# EAGLE design Adafruit AirLift Breakout (EAGLE 9.2.0)
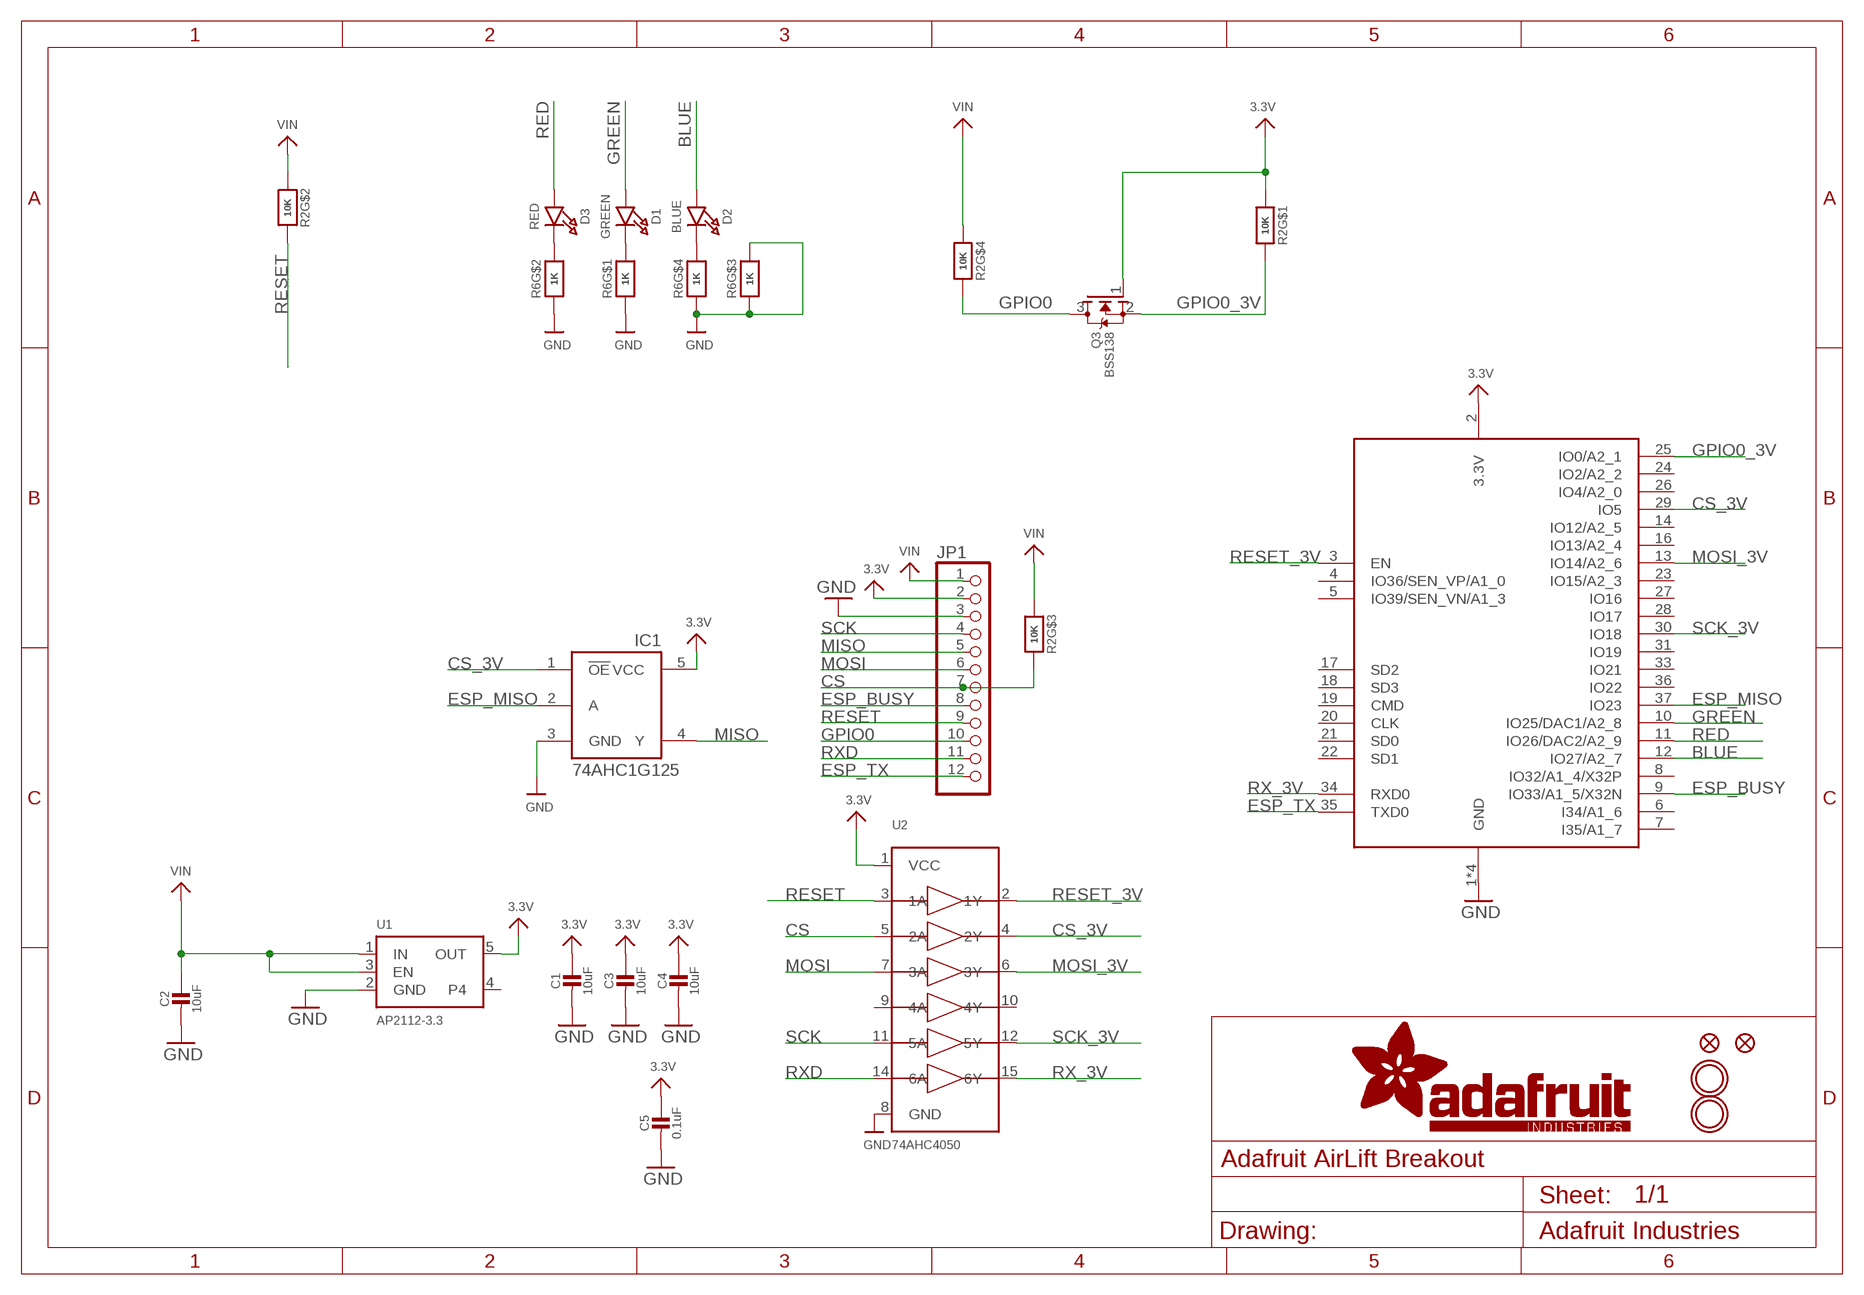
[diagram p0: schematic, sheet 1]

## Parts
C1  10uF  CAP_CERAMIC0805-NOOUTLINE  [0805-NO]
C2  10uF  CAP_CERAMIC0805-NOOUTLINE  [0805-NO]
C3  10uF  CAP_CERAMIC0805-NOOUTLINE  [0805-NO]
C4  10uF  CAP_CERAMIC0805-NOOUTLINE  [0805-NO]
C5  0.1uF  CAP_CERAMIC0603_NO  [0603-NO]
D1  GREEN  LED0603_NOOUTLINE  [CHIPLED_0603_NOOUTLINE]
D2  BLUE  LED0603_NOOUTLINE  [CHIPLED_0603_NOOUTLINE]
D3  RED  LED0603_NOOUTLINE  [CHIPLED_0603_NOOUTLINE]
FID1  FIDUCIAL_1MM  [FIDUCIAL_1MM]
FID3  FIDUCIAL_1MM  [FIDUCIAL_1MM]
IC1  74AHC1G125  [SOT23-5L]
JP1  HEADER-1X12  [1X12_ROUND]
Q3  BSS138  MOSFET-NWIDE  [SOT23-WIDE]
R2  10K  RESISTOR_4PACK  [RESPACK_4X0603]
R6  1K  RESISTOR_4PACK  [RESPACK_4X0603]
U1  AP2112-3.3  VREG_SOT23-5  [SOT23-5]
U2  74AHC4050  74HC4050DTSSOP  [TSSOP16]
U$15  MOUNTINGHOLE2.5  [MOUNTINGHOLE_2.5_PLATED]
U$16  MOUNTINGHOLE2.5  [MOUNTINGHOLE_2.5_PLATED]
X1  ESP32_WROOM32  [WROOM32]

## Nets
3.3V: C1.1 C3.1 C4.1 C5.1 IC1.5(VCC) JP1.2 Q3.1(G) R2.8 U1.5(OUT) U2.1(VCC) X1.2(3.3V)
BLUE: D2.A X1.12(IO27/A2_7)
CS: JP1.7 R2.6 U2.5(2A)
CS_3V: IC1.1(!OE) U2.4(2Y) X1.29(IO5)
ESP_BUSY: JP1.8 X1.9(IO33/A1_5/X32N)
ESP_MISO: IC1.2(A) X1.37(IO23)
ESP_TX: JP1.12 X1.35(TXD0)
GND: C1.2 C2.2 C3.2 C4.2 C5.2 IC1.3(GND) JP1.3 R6.1 R6.2 R6.3 R6.4 R6.6 U1.2(GND) U2.8(GND) X1.1(GND) X1.15(GND) X1.38(GND) X1.P$1(GND)
GPIO0: JP1.10 Q3.3(D) R2.4
GPIO0_3V: Q3.2(S) R2.1 X1.25(IO0/A2_1)
GREEN: D1.A X1.10(IO25/DAC1/A2_8)
MISO: IC1.4(Y) JP1.5
MOSI: JP1.6 U2.7(3A)
MOSI_3V: U2.6(3Y) X1.13(IO14/A2_6)
N$1: D3.C R6.7
N$2: D1.C R6.8
N$3: D2.C R6.5
RED: D3.A X1.11(IO26/DAC2/A2_9)
RESET: JP1.9 R2.7 U2.3(1A)
RESET_3V: U2.2(1Y) X1.3(EN)
RX_3V: U2.15(6Y) X1.34(RXD0)
RXD: JP1.11 U2.14(6A)
SCK: JP1.4 U2.11(5A)
SCK_3V: U2.12(5Y) X1.30(IO18)
VIN: C2.1 JP1.1 R2.2 R2.3 R2.5 U1.1(IN) U1.3(EN)
Unconnected: U1.4 U2.9(4A) U2.10(4Y) X1.4(IO36/SEN_VP/A1_0) X1.5(IO39/SEN_VN/A1_3) X1.6(I34/A1_6) X1.7(I35/A1_7) X1.8(IO32/A1_4/X32P) X1.14(IO12/A2_5) X1.16(IO13/A2_4) X1.17(SD2) X1.18(SD3) X1.19(CMD) X1.20(CLK) X1.21(SD0) X1.22(SD1) X1.23(IO15/A2_3) X1.24(IO2/A2_2) X1.26(IO4/A2_0) X1.27(IO16) X1.28(IO17) X1.31(IO19) X1.33(IO21) X1.36(IO22)

## Library data of the parts
C1-C5 = microbuilder:CAP_CERAMIC: Ceramic Capacitors For new designs, use the packages preceded by an '_' character since they are more reliable: The following footprints should be used on most boards: _0402 - Standard footprint for regular board layouts _0603 - Standard footprint for regular board layouts _0805 - Standard footprint for regular board layouts _1206 - Standard footprint for regular board layouts For extremely tight-pitch boards where space is at a premium, the following 'micro-pitch' footprints can be used (smaller pads, no silkscreen outline, etc.): _0402MP - Micro-pitch footprint for very dense/compact boards _0603MP - Micro-pitch footprint for very dense/compact boards _0805MP - Micro-pitch footprint for very dense/compact boards _1206MP - Micro-pitch footprint for very dense/compact boards
D1-D3 = microbuilder:LED: LED 0603 - 0603 Surface Mount Package 2mA: Green LED - Low Power (3.9mcd, 2ma, 1.7Vf) - Digikey: 475-2709-2-ND Orange LED - Low Power (9.8mcd, 2ma, 1.8Vf) - Digikey: 475-1194-2-ND Red LED - Low Power (5mcd, 2ma, 1.8Vf) - Digikey: 475-1195-2-ND Yellow LED - Low Power (7mcd, 2ma, 1.8Vf) - Digikey: 475-1196-2-ND 5mA: Blue LED - Low Power (17mcd, 5ma, 2.9Vf) - Digikey: LNJ937W8CRACT-ND 0805 - 0805 Surface Mount Package 2mA: Red LED (8.8mcd, 2mA, 1.8Vf, Clear) - Low Power [Digikey: 475-2510-1-ND] Green LED (5mcd, 2mA, 1.8Vf, Clear) - Low Power [Digikey: 475-2730-1-ND] Yellow LED (11.3mcd, 2mA, 1.8Vf, Clear) - Low Power [Digikey: 475-2555-1-ND] 20mA: Red LED (104mcd, 20mA, Diffused) - LS R976 [Digikey: 475-1278-6-ND] Red LED (12mcd, 20mA, 2.0Vf, Clear) - APT2012EC [Digikey: 754-1128-1-ND] Green LED (15mcd, 20mA, 2.2Vf, Clear) - APT2012GC [Digikey: 754-1131-1-ND] Orange LED (160mcd, 20mA, 2.1Vf, Clear) - APT2012SECK [Digikey: 754-1130-1-ND] 1206 - 1206 Surface Mount Package Green LED (26mcd, 20mA, Diffused) - LG N971 [Digikey: 475-1407-6-ND] Red LED (15mcd, 20mA, Diffused) - LH N974 [Digikey: 475-1416-6-ND] Cree - Cree High-Power Surface Mount LEDs XPEBWT-L1-0000-00D50 - White 111lm 350mA 2.9Vf 6200K 110° XTEAWT-00-0000-00000LEE3 - White 114lm 350mA 2.85Vf 5000K 115° Everlight - Everlight 45-21 Series Surface Mount LEDs 45-21/QK2C-B2832AC2CB2/2T - Warm White 2000mcd 20mA 3.25Vf 3050K 120° 45-21/LK2C-B38452C4CB2/2T - Nuetral White 2000mcd 20mA 3.25Vf 4150K 120° 45-21/LK2C-B50634C6CB2/2T - Cold White 2200mcd 20mA 3.25Vf 5650K 120° PLCC2 Reverse Mount LS T77K-J1L2-1-0-2-R18-Z - Red 11.25mcd 2mA 1.8Vf 630nm 120° LO T77K-L1M2-24-Z - Orange 19.6mcd 2mA 1.8Vf 606nm 120° LY T77K-K2M1-26-Z - Yellow 15.7mcd 2mA 1.8Vf 587nm 120°
FID1 FID3 = microbuilder:FIDUCIAL: Fiducial Alignment Points Various fiducial points for machine vision alignment.; BOM: EXCLUDE
IC1 = adafruit:74AHC1G125
JP1 = microbuilder:HEADER-1X12
Q3 = microbuilder:MOSFET-N: N-Channel Mosfet LEGEND VDS: Voltage Drain-Source ID: Drain Current RDS(ON): Drain-Source On-State Resistance VGS(TH): Gate-Source Threshold Voltage CISS: Drain-Source Input Capacitance SOT-23 Name VDS ID RDS(ON) VGS(TH) CISS Order Number 2N7002E 60V 260mA 2.5 Ohm 2.5V @ 250uA 26.7pF @ 25V 2N7002ET1GOSTR-ND BSH103 30V 850mA 400 mOhm 400mV @ 1mA 83pF @ 24V BSH103,235-ND BSS138 60V 320mA 1.6 Ohm 1.5V @ 250uA 50pF @ 10V Mouser: 771-BSS138PW115 DMN2075U-7 20V 4.2A 38 mOhm 1V @ 250 uA 594.3pF @ 10V DMN2075U-7DICT-ND * BSS138 good choice for I2C level-shifting POWERPAK 1212-8 Name VDS ID RDS(ON) VGS(TH) CISS Order Number Si7308DN 60V 6A 58 mOhm 3V @ 250uA 665pF @ 15V SI7308DN-T1-E3CT-ND
R2 R6 = microbuilder:RESISTOR_4PACK: Resistor Packs (4 resistors) 4 x 0603 10K 1/16W - Digikey: YC164J-10KCT-ND
U1 = microbuilder:VREG_SOT23-5: SOT23-5 Fixed Voltage Regulators Part Current Out V Out V In V Dropout θJA (°C/W) TJ (°C) Digikey Part No. ADP121 150mA 3.3V 3.4-5.5V 0.09V @ 150mA -- -- ADP121-AUJZ33R7CT-ND ADP121 150mA 3.0V 3.1-5.5V 0.09V @ 150mA -- -- ADP121-AUJZ30R7CT-ND ADP122 300mA 3.3V 3.4-5.5V 0.085V @ 300mA -- -- ADP122AUJZ-3.3-R7CT-ND ADP1712 300mA 3.3V 3.5-5.5V 0.17V @ 300mA -- -- ADP1712AUJZ-3.3-R7TR-ND AP7311 (Low Cost) 150mA 3.3V 3.5-6V 0.15V @ 150mA -- -- AP7311-33WG-7DICT-ND LD39015M18R 150mA 1.8V 1.9V-5.5V 0.08V @ 100mA -- -- 497-6977-1-ND LP2985A-33DBVR 150mA 3.3V 3.3-16V 0.28V @ 150mA 206 150 296-18479-1-ND MCP1824T-3302E/OT 300mA 3.3V 3.5V-6V 0.2V @ 300mA -- -- MCP1824T-3302E/OTCT-ND MIC5205-2.5YM5 TR 150mA 2.5V 2.7-16V 0.165V @ 150mA -- -- 576-1257-2-ND MIC5205-3.0YM5 TR 150mA 3.0V 3.2V-16V 0.165V @ 150mA -- -- 576-1258-2-ND MIC5205-3.3YM5 TR 150mA 3.3V 3.5V-16V 0.165V @ 150mA -- -- 576-1259-2-ND TPS780330220 150mA 3.3V+2.2V 3.6-5.5V 250mV Max -- -- 296-23332-1-ND TDA3663/N1,135 100mA 3.3V 3.5-45V 0.18V @ 50mA -- -- 568-5343-1-ND Max operating temp can be calculated using θJA, TJ (max junction temperature), and power in watts. Set the "Maximum Ambient Temperature" until it reaches TJ ("Max Junction Temperature"), which is the absolute limit for safe use of the regulator: Heat Sink Temperature Calculator <http://www.daycounter.com/Calculators/Heat-Sink-Temperature-Calculator.phtml> For example, With 12V source into a 3.3V LP2985 and a 30mA load, we are dissipating (12V-3.3V) * 0.03A = 0.261W. With a θJA of 206 °C/W, a TJ of 150°C, and 261mW we can safely use the chip without a heat sink up to 75°C (=147.1°C Junction Temperature).
U2 = microbuilder:74HC4050D: 6-channel level shifter 74HC4050D - 2V-6V Supply SOIC16 Digikey: 74HC4050D,653-ND Mouser: 771-74HC4050D-T TSSOP16 Digikey: 296-9215-1-ND Mouser:
U$15 U$16 = microbuilder:MOUNTINGHOLE: Mounting Hole For #2 screws (0.086"/2.18mm width, 0.094"/2.4mm hole) use 2.5mm; BOM: EXCLUDE
X1 = microbuilder:ESP32_WROOM32

## Net classes
1 power: width 0.305 mm

## Board
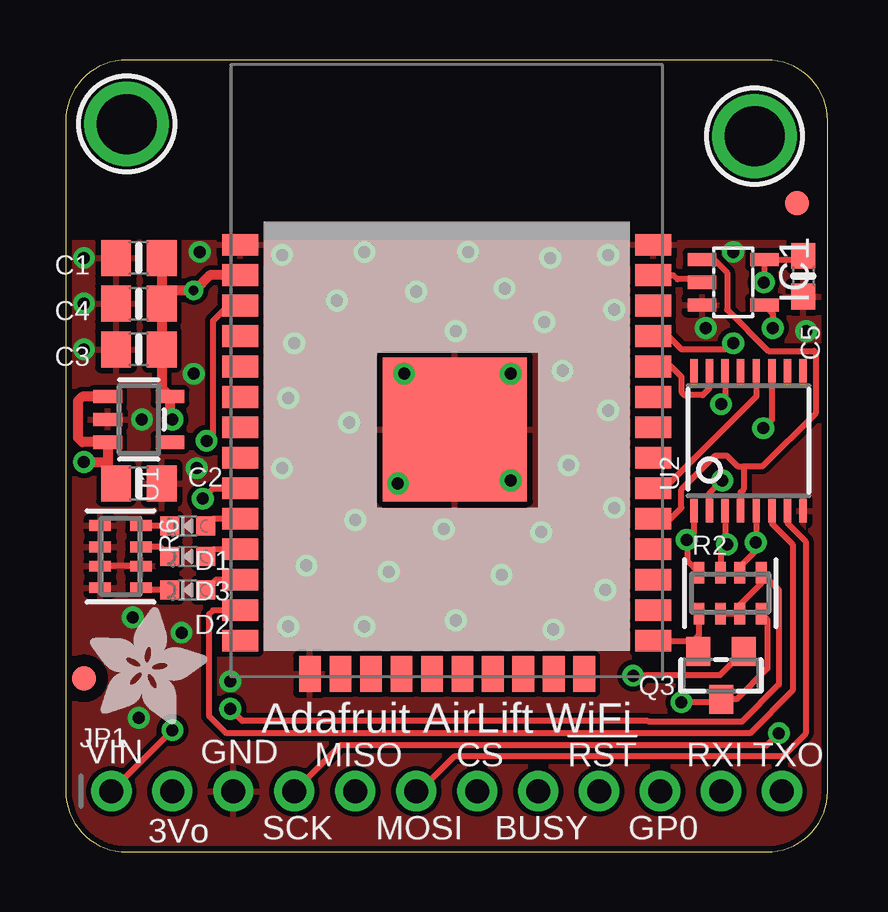
[diagram p1: board, top side]
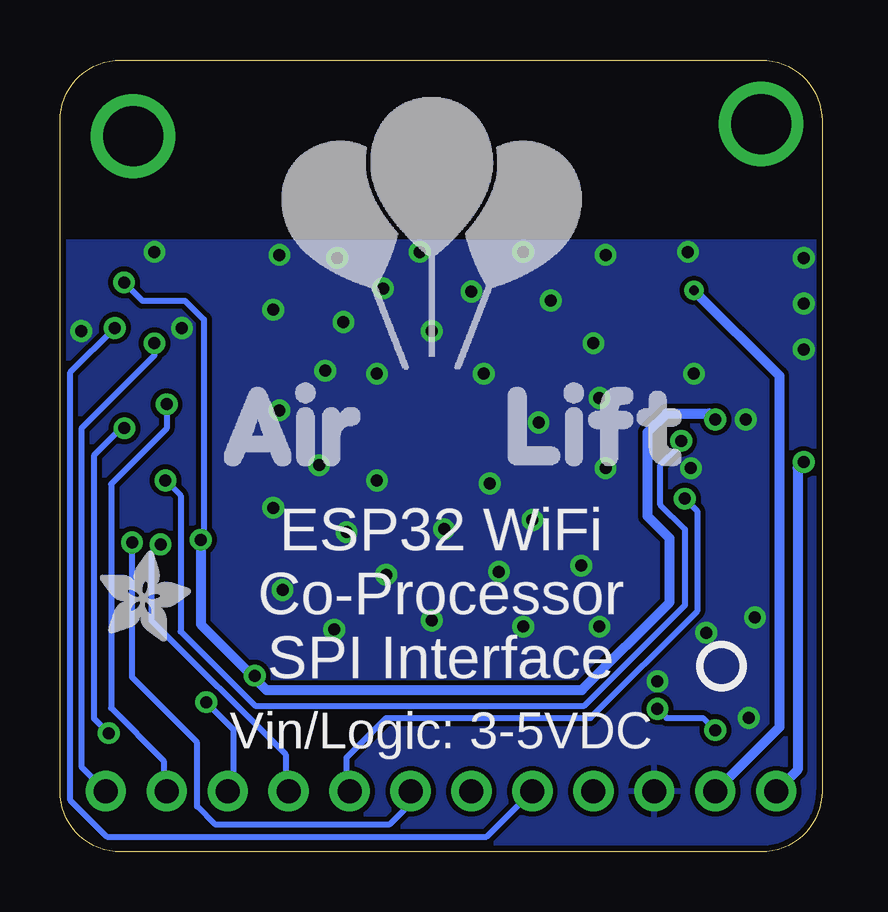
[diagram p2: board, bottom side, seen from below]

Size 31.75 x 33.02 mm. Coordinates in mm from the lower left corner, seen from the top.
Outline: 0,30.48 0,2.54 arc90 2.54,0 29.21,0 arc90 31.75,2.54 31.75,30.48 arc90 29.21,33.02 2.54,33.02 arc90 0,30.48
Copper layers (1*16): Top 0.035mm / dielectric 1.5mm / Bottom 0.035mm
Design rules "adafruit *": minimum track width 10mil, minimum drill 15.5mil, track to track 8mil, track to pad 8mil, pad to pad 8mil, via to via 8mil, smd to smd 8mil, copper to edge 10mil, drill to drill 8mil, minimum pad ring 10mil, minimum via ring 8mil, stop-mask expansion 2mil, vias tented up to drill 20mil, thermal gap 10mil

### Footprints (pad centres in the part's own frame; a part is rotated, then mirrored left to right if it is on the bottom)
0805-NO = smd 1.24 x 1.5: 1 -0.95,0; 2 0.95,0
0603-NO = smd 1.075 x 1: 1 -0.85,0; 2 0.85,0
CHIPLED_0603_NOOUTLINE = smd 0.8 x 0.8: A 0,-0.75; C 0,0.75
FIDUCIAL_1MM = smd 1 x 1: 1 0,0
SOT23-5L = smd 0.55 x 1.2: 1 -0.95,-1.3; 2 0,-1.3; 3 0.95,-1.3; 4 0.95,1.3; 5 -0.95,1.3
1X12_ROUND = drill 1 pad 1.676: 1 -13.97,0; 2 -11.43,0; 3 -8.89,0; 4 -6.35,0; 5 -3.81,0; 6 -1.27,0; 7 1.27,0; 8 3.81,0; 9 6.35,0; 10 8.89,0; 11 11.43,0; 12 13.97,0
SOT23-WIDE = smd 1 x 1.2: 1 -0.95,-1; 2 0.95,-1; 3 0,1
RESPACK_4X0603 = smd 0.45 x 0.9: 1 -1.3,-0.85; 2 -0.4,-0.85; 3 0.4,-0.85; 4 1.3,-0.85; 5 1.3,0.85; 6 0.4,0.85; 7 -0.4,0.85; 8 -1.3,0.85
SOT23-5 = smd 0.55 x 1.2: 1 -0.95,-1.3; 2 0,-1.3; 3 0.95,-1.3; 4 0.95,1.3; 5 -0.95,1.3
TSSOP16 = smd 0.305 x 0.991: 1 -2.275,-2.918; 2 -1.625,-2.918; 3 -0.975,-2.918; 4 -0.325,-2.918; 5 0.325,-2.918; 6 0.975,-2.918; 7 1.625,-2.918; 8 2.275,-2.918; 9 2.275,2.918; 10 1.625,2.918; 11 0.975,2.918; 12 0.325,2.918; 13 -0.325,2.918; 14 -0.975,2.918; 15 -1.625,2.918; 16 -2.275,2.918
MOUNTINGHOLE_2.5_PLATED = drill 2.5 pad 3.2: P$1 0,0
WROOM32 = smd 1.5 x 0.9: 1 -8.6,5; 2 -8.6,3.73; 3 -8.6,2.46; 4 -8.6,1.19; 5 -8.6,-0.08; 6 -8.6,-1.35; 7 -8.6,-2.62; 8 -8.6,-3.89; 9 -8.6,-5.16; 10 -8.6,-6.43; 11 -8.6,-7.7; 12 -8.6,-8.97; 13 -8.6,-10.24; 14 -8.6,-11.51; 25 8.6,-11.51; 26 8.6,-10.24; 27 8.6,-8.97; 28 8.6,-7.7; 29 8.6,-6.43; 30 8.6,-5.16; 31 8.6,-3.89; 32 8.6,-2.62; 33 8.6,-1.35; 34 8.6,-0.08; 35 8.6,1.19; 36 8.6,2.46; 37 8.6,3.73; 38 8.6,5 | smd 0.9 x 1.5: 15 -5.7,-12.9; 16 -4.43,-12.9; 17 -3.16,-12.9; 18 -1.89,-12.9; 19 -0.62,-12.9; 20 0.65,-12.9; 21 1.92,-12.9; 22 3.19,-12.9; 23 4.46,-12.9; 24 5.73,-12.9 | smd 6 x 6: P$1 0.34,-2.7

### Placement (x,y rotation side)
C1  3.05,24.77 180 top
C2  3.05,15.37 0 top
C3  3.05,20.95 180 top
C4  3.05,22.86 180 top
C5  30.73,24 270 top
D1  5.08,13.59 90 top
D2  5.08,10.92 90 top
D3  5.08,12.32 90 top
FID1  0.76,7.24 0 top
FID3  30.48,27.05 0 top
IC1  27.81,23.75 270 top
JP1  15.88,2.54 0 top
Q3  27.3,7.37 180 top
R2  27.69,10.79 0 top
R6  2.29,12.32 270 top
U1  3.05,18.03 270 top
U2  28.45,17.14 0 top
U$2  [ADAFRUIT_3.5MM]  30.1,8.76 0 bottom
U$13  [PCBFEAT-REV-040]  4.19,7.75 0 bottom
U$15  2.54,30.35 0 top
U$16  28.7,29.84 0 top
U$21  [ADAFRUIT_5MM]  1.02,5.33 0 top
U$24  [AIRLIFT]  24.89,14.73 0 bottom
X1  15.88,20.32 0 top

### Tracks (layer width: path | path; a pad name or v marks a point on that pad's centre or on a via)
3.3V  (via drill 0.39, 0.5)
  Top 0.254: v25.88,13.02 25.93,13.06 | 25.93,13.06 26.17,13.31 U2.1 | v29.08,23.75 29.11,23.78 IC1.5 30.33,24.7 30.48,24.85 C5.1 | R2.8 25.93,12.11 25.93,13.06 | Q3.1 27.25,7.37 23.62,7.37 v23.64,7.35
  Top 0.406: C4.1 C3.1 4,19.33 U1.5 4.35,18.13 v4.45,18.03 | C1.1 C4.1 | X1.2 6,24.05 5.37,23.41 v5.33,23.41 4.55,23.41 C4.1
  Bottom 0.254: v25.88,13.02 25.75,13.02 25.75,22.2 26.54,22.99 28.32,22.99 v29.08,23.75
  Bottom 0.406: v25.88,13.02 25.88,9.5 23.73,7.35 v23.64,7.35 23.64,7.25 23.15,6.76 10.01,6.76 6.35,10.41 6.35,13.08 7.26,13.99 7.26,17.5 6.48,18.29 4.7,18.29 v4.45,18.03 | v5.33,23.41 1.78,19.86 1.78,5.21 JP1.2
BLUE
  Top 0.254: X1.12 6.26,11.35 D2.A
CS  (via drill 0.5)
  Top 0.254: U2.5 28.77,12.93 | 28.77,12.93 v28.75,12.91 | R2.6 28.09,11.89 28.77,12.57 28.77,12.93
  Bottom 0.254: JP1.7 17.14,2.03 18.03,1.14 25.27,1.14 26.04,1.91 26.04,4.57 28.75,7.29 v28.75,12.91
CS_3V
  Top 0.254: IC1.1 27.02,24.7 27.56,24.16 27.56,22.61 29.28,20.89 31.18,20.89 31.24,20.83 31.24,18.29 29.03,16.07 28.25,16.07 | X1.29 25.19,13.89 25.65,14.35 25.65,15.11 27.05,16.51 27.56,16.51 28,16.07 28.25,16.07 | 28.25,16.07 28.25,15.12 28.12,14.99 U2.4
ESP_BUSY  (via drill 0.5)
  Top 0.254: v5.71,14.73 6.14,15.16 X1.9
  Bottom 0.254: v5.71,14.73 5.21,14.22 5.21,10.03 9.65,5.59 18.16,5.59 19.81,3.94 19.81,2.92 19.68,2.79 JP1.8
ESP_MISO
  Top 0.254: X1.37 25.32,24.05 25.5,23.88 26.39,23.88 IC1.2
ESP_TX  (via drill 0.5)
  Top 0.254: v27.81,21.21 27.56,20.95 25.66,20.95 25.11,21.51 X1.35
  Bottom 0.254: v27.81,21.21 27.81,20.7 30.86,17.65 30.86,3.56 JP1.12
GND  (via drill 0.5)
  Top 0.254: R6.6 R6.3 | R6.1 R6.2 R6.3 | R6.3 R6.4
  other vias: 26.67,21.84 27.81,25.02 5.59,25.02 5.33,19.94 3.17,18.03 5.46,16 0.76,22.86 0.76,24.77 0.76,20.95 9.02,24.89 11.3,22.99 9.53,21.21 11.81,17.91 9.02,16 12.06,13.84 10.03,11.94 9.27,9.4 12.45,9.4 13.46,11.68 15.75,13.46 16.26,9.65 18.16,11.56 19.81,13.34 20.32,9.27 22.48,10.92 22.86,14.35 20.95,16.13 22.61,18.41 20.7,20.07 22.86,22.61 22.61,24.89 20.19,24.77 19.94,22.1 18.29,23.5 16.76,25.02 16.26,21.72 14.61,23.37 12.45,25.02 9.27,18.92 14.1,19.94 18.54,19.94 18.54,15.49 13.84,15.37 30.86,21.72 6.86,7.11 4.83,9.14 2.79,9.78 3.05,5.59
  pour Top: 0,25.4 31.75,25.4 31.75,0 0,0
  pour Bottom: 0,25.4 31.75,25.4 31.75,0 0,0
GPIO0  (via drill 0.5)
  Top 0.254: v25.65,6.24 27.18,6.24 Q3.3 27.96,6.37 29.24,7.65 29.24,9.69 R2.4
  Bottom 0.254: v25.65,6.24 24.51,5.1 24.51,2.79 JP1.10
GPIO0_3V
  Top 0.254: 26.36,9.02 Q3.2 | X1.25 25.97,8.81 25.97,8.64 26.36,9.02 | R2.1 26.39,9.05 26.36,9.02
GREEN
  Top 0.254: X1.10 6.13,13.89 D1.A
MISO  (via drill 0.5)
  Top 0.254: IC1.4 29.46,22.45 v29.46,21.84
  Bottom 0.254: JP1.5 13.97,0.64 29.79,0.64 31.32,2.16 31.32,20 29.48,21.84 v29.46,21.84
MOSI
  Top 0.254: U2.7 30.07,13.72 30.84,12.96 30.84,4.93 29.9,3.99 16.18,3.99 14.73,2.54 JP1.6
MOSI_3V
  Top 0.254: X1.13 6.14,10.08 5.97,9.91 5.97,5.68 6.7,4.95 28.52,4.95 30.29,6.73 30.29,12.83 29.42,13.7 U2.6
N$1
  Top 0.254: D3.C 3.93,12.72 R6.7
N$2
  Top 0.254: D1.C 3.17,13.59 R6.8
N$3
  Top 0.254: D2.C 3.23,10.92 R6.5
RED
  Top 0.254: X1.11 6.13,12.62 D3.A
RESET  (via drill 0.5)
  Top 0.254: R2.7 27.29,12.73 27.47,12.91 | U2.3 27.47,12.91 | 27.47,12.91 v27.56,12.83
  Bottom 0.254: JP1.9 22.35,2.67 22.35,4.06 27.94,9.65 27.94,12.45 v27.56,12.83
RESET_3V  (via drill 0.5)
  Top 0.254: X1.3 6.77,22.78 6.13,22.14 6.13,17.41 v5.87,17.14 | v27.36,15.49 26.82,14.96 U2.2
  Bottom 0.254: v5.87,17.14 5.99,17.02 5.99,16.87 6.73,16.13 6.73,14.48 5.71,13.46 5.71,10.29 9.91,6.1 23.62,6.1 26.72,9.19 26.72,14.86 v27.36,15.49
RX_3V
  Top 0.254: U2.15 26.82,19.33 26.54,19.05 25.78,19.05 25.65,19.18 25.65,19.81 25.23,20.24 X1.34
RXD  (via drill 0.5)
  Top 0.254: U2.14 27.47,18.84 v27.3,18.67
  Bottom 0.254: v27.3,18.67 27.3,17.65 29.62,15.33 29.62,6 27.43,3.81 27.43,2.67 JP1.11
SCK  (via drill 0.5)
  Top 0.254: U2.11 29.42,18.03 v29.07,17.67 | JP1.4 11.43,4.45 29.21,4.45 v29.72,4.95
  Bottom 0.254: v29.07,17.67 29.19,17.67 30.34,16.53 30.34,5.57 v29.72,4.95
SCK_3V
  Top 0.254: X1.30 24.94,15.16 28.77,18.99 U2.12
VIN  (via drill 0.5)
  Top 0.254: R2.2 28.07,9.95 | 28.07,9.95 R2.3 | 28.07,9.95 28.07,10.29 28.99,11.21 R2.5 29.72,10.92 29.72,6.99 28.17,5.44 24.28,5.44 24.26,5.46 7.37,5.46 v6.86,5.97 | v4.45,5.08 JP1.1
  Top 0.406: 1.75,16.26 1.75,15.72 C2.1 | U1.1 0.7,18.98 0.51,18.8 0.51,17.27 0.7,17.08 U1.3 1.75,16.26 | v0.76,16.26 1.75,16.26
  Bottom 0.254: v6.86,5.97 6.48,5.59 4.95,5.59 v4.45,5.08
  Bottom 0.406: v0.76,16.26 1.02,16 1.02,3.43 JP1.1

### Text on the board
tPlace: Adafruit AirLift WiFi | VIN | GND | MISO | CS | !RST | RXI | TXO | 3Vo | SCK | MOSI | BUSY | GP0
bPlace: ESP32 WiFi / Co-Processor / SPI Interface | Vin/Logic: 3-5VDC